# EasyEDA Pro project MSPM0G3507.eprj, schematic V1
Create Date: 2024-07-22; Page Name: P1; Project Name: MSPM0G3507; Schematic Name: V1; Update Date: 2024-07-22
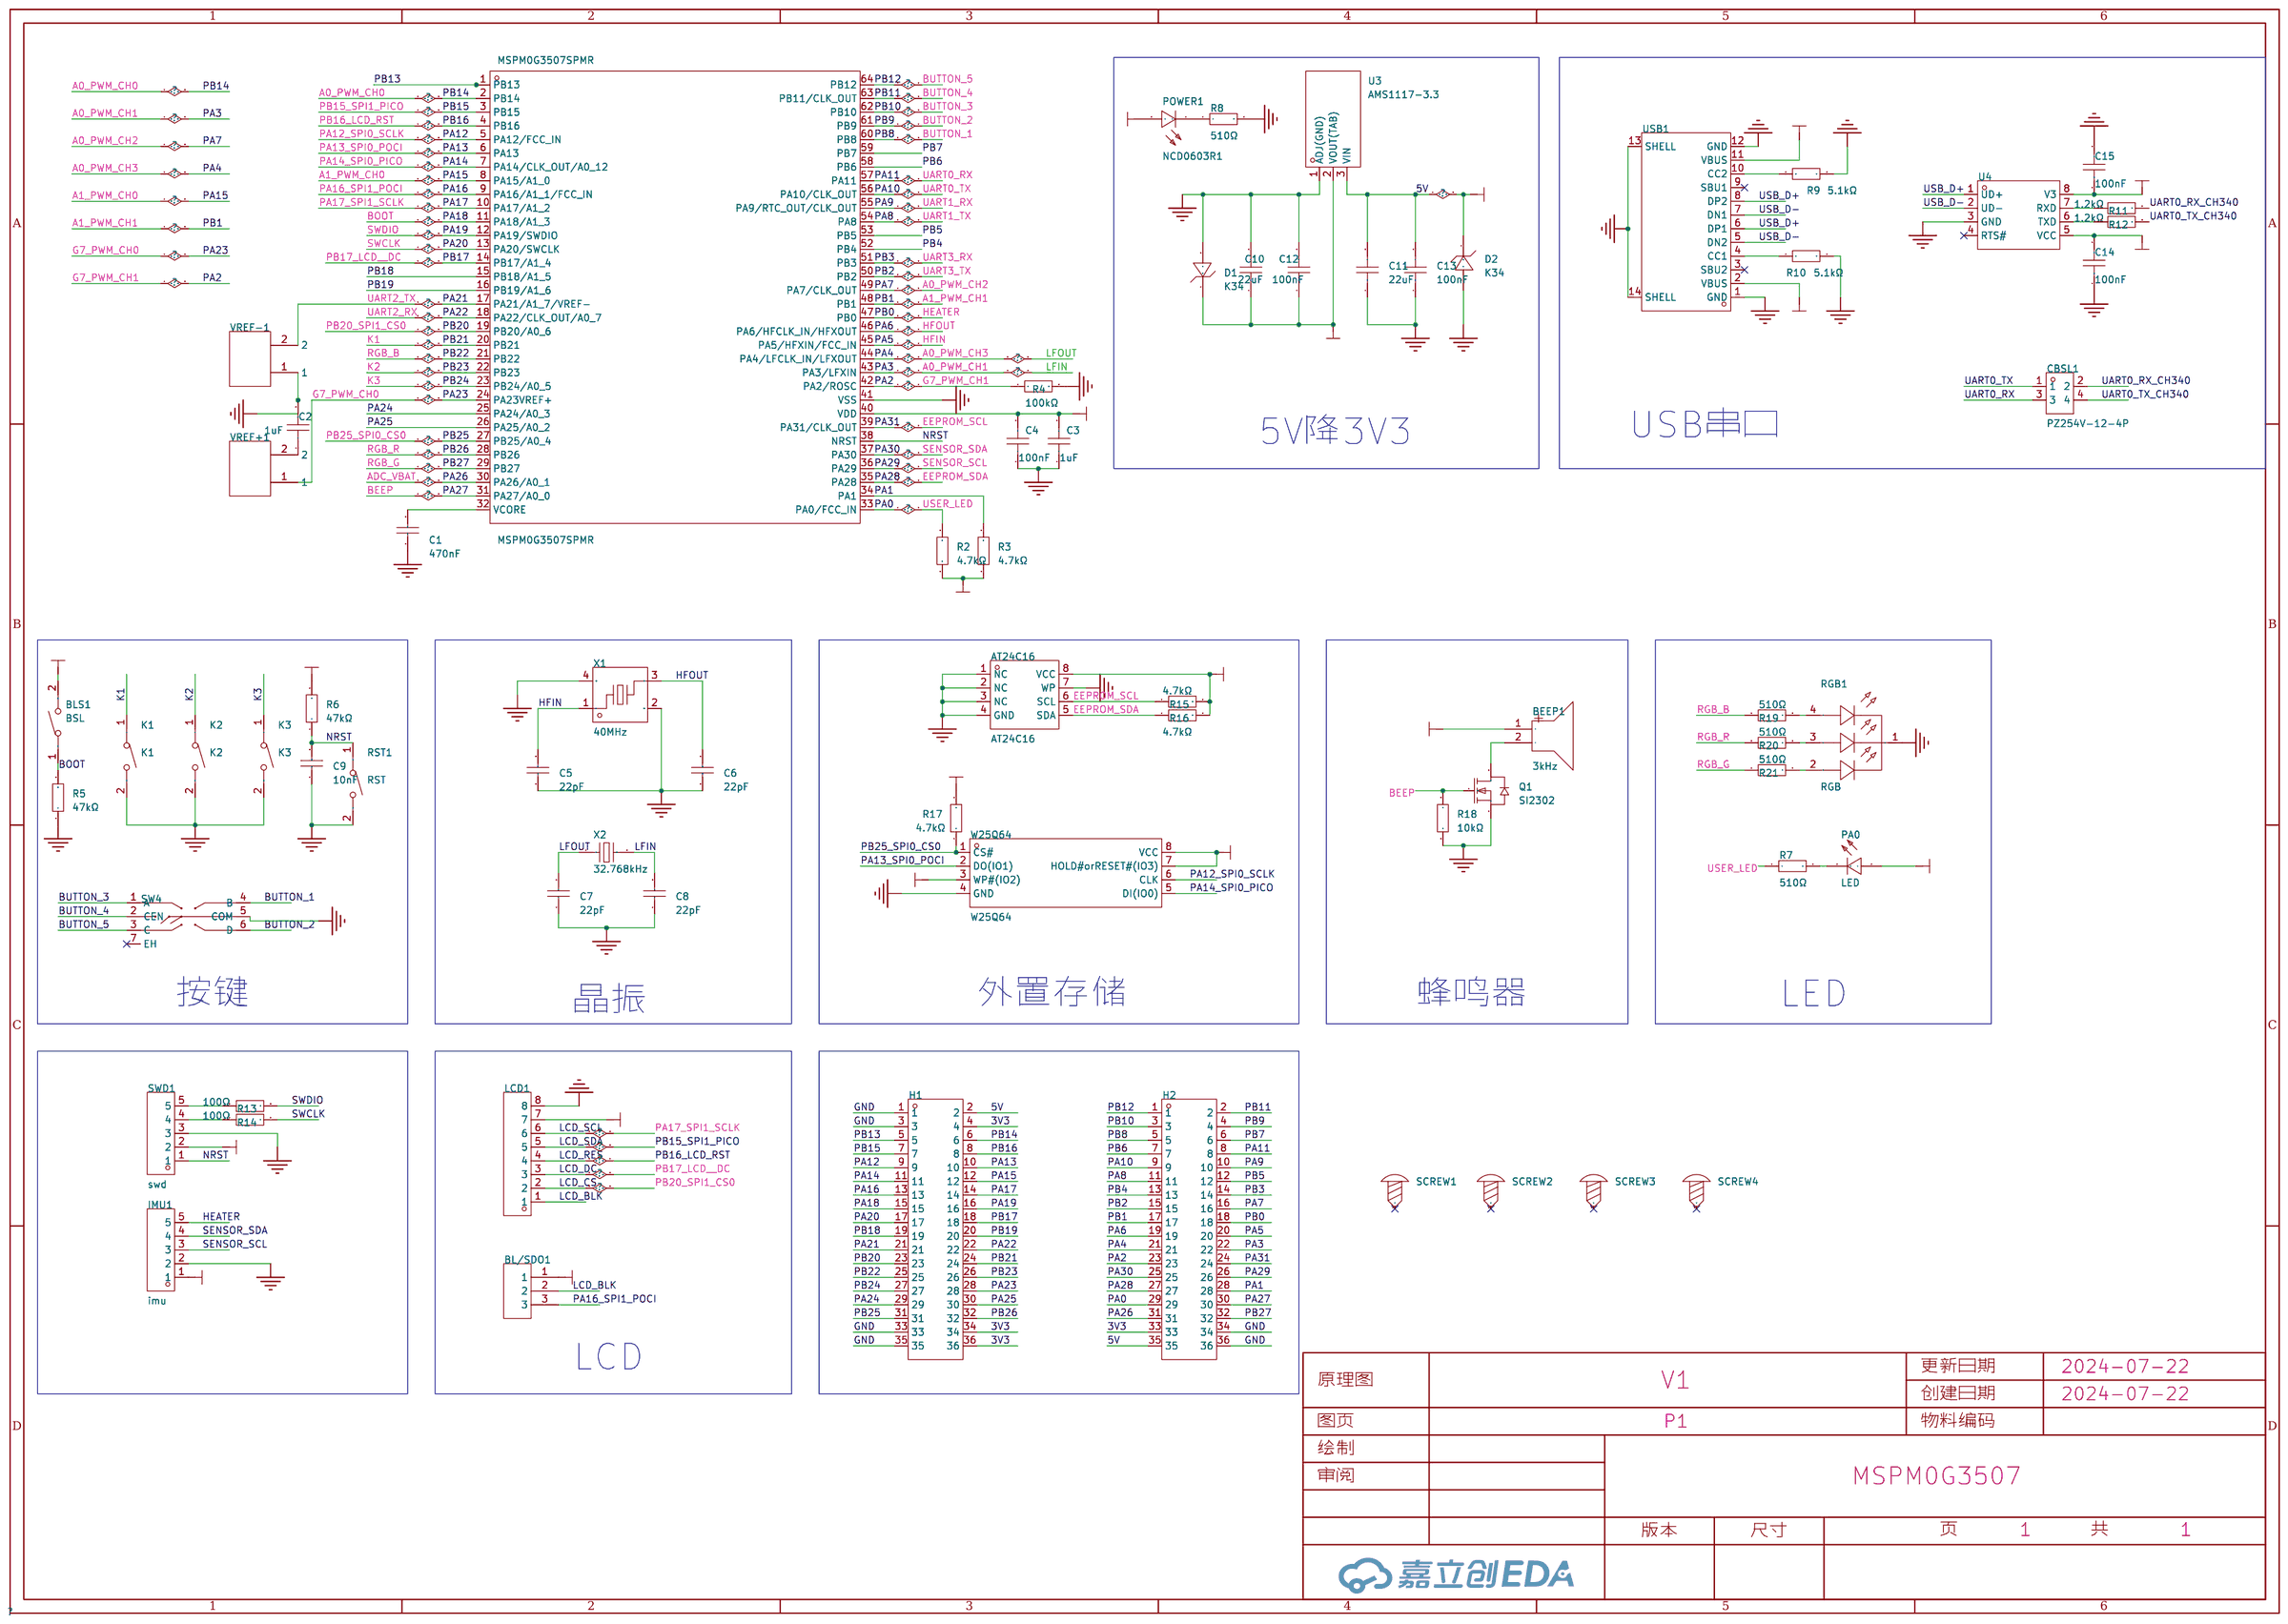
[diagram p0: schematic sheet]

## Parts
AT24C16  AT24C16  [SOP-8_L5.0-W4.0-P1.27-LS6.0-BL]
BEEP1  3kHz  [BUZ-TH_BD9.0-P5.00-D0.6-FD]
BL/SDO1  -  [3焊盘短接]
BLS1  BSL  [SW-SMD_L3.9-W3.0-P4.45]
C1  470nF  [C0603]
C2  1uF  [C0603]
C3  1uF  [C0603]
C4  100nF  [C0603]
C5  22pF  [C0603]
C6  22pF  [C0603]
C7  22pF  [C0603]
C8  22pF  [C0603]
C9  10nF  [C0603]
C10  22uF  [C0603]
C11  22uF  [C0603]
C12  100nF  [C0603]
C13  100nF  [C0603]
C14  100nF  [C0603]
C15  100nF  [C0603]
CBSL1  PZ254V-12-4P  [HDR-TH_4P-P2.54-V-M-R2-C2-S2.54]
D1  K34  [SOD-123FL_L2.8-W1.8-LS3.7-RD-1]
D2  K34  [SOD-123FL_L2.8-W1.8-LS3.7-RD-1]
H1  X6521WV-2x18H-C60D30  [HDR-TH_36P-2.54-V-M-R2-C18-S2.54]
H2  X6521WV-2x18H-C60D30  [HDR-TH_36P-2.54-V-M-R2-C18-S2.54]
IMU1  imu  [CONN-TH_5P-P2.50_ZX-XH2.54-5PZZ]
K1  K1  [SW-SMD_L3.9-W3.0-P4.45]
K2  K2  [SW-SMD_L3.9-W3.0-P4.45]
K3  K3  [SW-SMD_L3.9-W3.0-P4.45]
LCD1  PM254-1-08-Z-8.5  [HDR-TH_8P-P2.54-V-F]
MSPM0G3507SPMR  MSPM0G3507SPMR  [LQFP-64_L10.0-W10.0-P0.50-LS12.0-BL]
PA0  LED  [LED0603-RD_RED]
POWER1  NCD0603R1  [LED0603-RD_RED]
Q1  SI2302  [SOT-23-3_L2.9-W1.3-P1.90-LS2.4-BR]
R2  4.7kΩ  [R0603]
R3  4.7kΩ  [R0603]
R4  100kΩ  [R0603]
R5  47kΩ  [R0603]
R6  47kΩ  [R0603]
R7  510Ω  [R0603]
R8  510Ω  [R0603]
R9  5.1kΩ  [R0603]
R10  5.1kΩ  [R0603]
R11  1.2kΩ  [R0603]
R12  1.2kΩ  [R0603]
R13  100Ω  [R0603]
R14  100Ω  [R0603]
R15  4.7kΩ  [R0603]
R16  4.7kΩ  [R0603]
R17  4.7kΩ  [R0603]
R18  10kΩ  [R0603]
R19  510Ω  [R0603]
R20  510Ω  [R0603]
R21  510Ω  [R0603]
RGB1  RGB  [LED-ARRAY-SMD_4P-L3.2-W2.8-LS3.5-BL_XL-A3528RGBC-BM]
RST1  RST  [SW-SMD_L3.9-W3.0-P4.45]
SCREW1  -  [M3螺丝]
SCREW2  -  [M3螺丝]
SCREW3  -  [M3螺丝]
SCREW4  -  [M3螺丝]
SW4  TM-4175-B-A  [SW-SMD_TM-4175-B-X]
SWD1  swd  [CONN-TH_5P-P2.50_ZX-XH2.54-5PZZ]
U3  AMS1117-3.3  [SOT-89_L4.5-W2.5-P1.50-LS4.2-BR]
U4  CH340N  [SOP-8_L4.9-W3.9-P1.27-LS6.0-BL]
USB1  TYPE-C 16PIN 2MD(073)  [USB-C-SMD_TYPE-C-6PIN-2MD-073]
VREF+1  -  [VREF]
VREF-1  -  [VREF]
W25Q64  W25Q64  [SOIC-8_L5.3-W5.3-P1.27-LS8.0-BL]
X1  40MHz  [CRYSTAL-SMD_4P-L3.2-W2.5-BL]
X2  32.768kHz  [OSC-SMD_L3.2-W1.5]

## Library data of the parts
AT24C16 = AT24C16_C561263: 接口类型:I2C;存储容量:-;时钟频率(fc):400kHz~1MHz;工作电压:1.8V~5.5V;读-工作电流:400uA;写-工作电流:2mA;待机电流:1uA;写周期时间(Tw):5ms;数据保留 - TDR(年):100年;写周期寿命:1000000次;工作温度:-40℃~+85℃;; LCSC Part Name: I2C Twc=5ms; Supplier Part: C561263; Manufacturer: IDCHIP(英锐芯); Supplier Footprint: SOP-8; JLCPCB Part Class: 扩展库; Datasheet: https://atta.szlcsc.com/upload/public/pdf/source/20200527/C561263_AC234663A499CF0B5C3BE8C2059C2B18.pdf; Supplier: LCSC; Interface Type: I2C; Clock Frequency (fc): 400kHz~1MHz; Supply Voltage: 1.8V~5.5V; Supply Current (Read): 400uA; Supply Current (Write): 2mA; Standby supply current: 1uA; Write Cycle Time (Tw): 5ms; Data Retention - TDR (Year): 100年; Write Cycle Endurance: 1000000次; Operating Temperature: -40℃~+85℃
BEEP1 = HNB09A03: 驱动方式:有源(内含驱动线路);构造类型:电磁式;额定电压:3V;工作电压:1.5V~4.5V;消耗电流:30mA;频率:3kHz;声压(SPL):85dB@10cm;直径(φD):9mm;长度:-;宽度:-;高度:5.5mm;工作温度:-20℃~+70℃;; LCSC Part Name: 电磁式有源一体蜂鸣器HNB09A03; Supplier Part: C96102; Manufacturer: 华能; Supplier Footprint: 插件,D=9mm; JLCPCB Part Class: 扩展库; Datasheet: https://atta.szlcsc.com/upload/public/pdf/source/20170522/1495448326172.pdf; Supplier: LCSC; Oscillator Circuit: 有源(内含驱动线路); Technology Type: 电磁式; Rated Voltage: 3V; Operating Voltage: 1.5V~4.5V; Current Consumption: 30mA; Sound Pressure Level (SPL): 85dB@10cm; Diameter (φD): 9mm; Height: 5.5mm; Operating Temperature: -20℃~+70℃
BL/SDO1 = 3焊盘短接
BLS1 K1-K3 RST1 = TS-1088-AR02016: 电路结构:单刀单掷;按钮形状:圆形按钮;作用力:160gf;安装方式:立贴;开关长度:4mm;开关宽度:3mm;开关高度:2mm;带支架:不带;触点电流:50mA;额定电压(DC):12V;绝缘电阻:100MΩ;机械寿命:10万次;; LCSC Part Name: 4*3*2mm 立贴 轻触开关; Supplier Part: C720477; Manufacturer: XUNPU(讯普); Supplier Footprint: SMD; JLCPCB Part Class: Extended Part; Datasheet: https://atta.szlcsc.com/upload/public/pdf/source/20200810/C720475_60D09DD6C54279ADDB2DC25100F1CC11.pdf; Supplier: LCSC; Circuit: 单刀单掷; Actuator Style: 圆形按钮; Operating Force: 160gf; Mounting Style: 立贴; Switch Length: 4mm; Switch Width: 3mm; Switch Height: 2mm; Strike Gundam: 不带; Contact Current: 50mA; Voltage Rating (DC): 12V; Insulation Resistance: 100MΩ; Actuator/Cap Color: 黑色; Pin Style: SMD接片; Mechanical Life: 10万次; Operating Temperature: -30℃~+80℃
C1 = CL10B474KA8NNNC: 容值:470nF;精度:±10%;额定电压:25V;材质(温度系数):X7R;; LCSC Part Name: 470nF ±10% 25V; Supplier Part: C1623; Manufacturer: SAMSUNG(三星); Supplier Footprint: 0603; JLCPCB Part Class: Basic Part; Datasheet: https://atta.szlcsc.com/upload/public/pdf/source/20160218/1457707763339.pdf; Supplier: LCSC; Tolerance: ±10%; Voltage Rated: 25V; Temperature Coefficient: X7R
C2 C3 = CL10A105KB8NNNC: 容值:1uF;精度:±10%;额定电压:50V;材质(温度系数):X5R;; LCSC Part Name: 1uF ±10% 50V; Supplier Part: C15849; Manufacturer: SAMSUNG(三星); Supplier Footprint: 0603; JLCPCB Part Class: Basic Part; Datasheet: https://atta.szlcsc.com/upload/public/pdf/source/20160218/1457707763339.pdf; Supplier: LCSC; Tolerance: ±10%; Voltage Rated: 50V; Temperature Coefficient: X5R
C4 C12-C15 = CC0603KRX7R9BB104: 容值:100nF;精度:±10%;额定电压:50V;材质(温度系数):X7R;; LCSC Part Name: 100nF ±10% 50V; Supplier Part: C14663; Manufacturer: YAGEO(国巨); Supplier Footprint: 0603; JLCPCB Part Class: Basic Part; Datasheet: https://atta.szlcsc.com/upload/public/pdf/source/20180910/C282072_33301C7F631E79921B82A8DAC6BCC5B3.pdf; Supplier: LCSC; Tolerance: ±10%; Voltage Rated: 50V; Temperature Coefficient: X7R
C5-C8 = CC0603JRNPO9BN220: 容值:22pF;精度:±5%;额定电压:50V;材质(温度系数):NP0;; LCSC Part Name: 22pF ±5% 50V; Supplier Part: C105620; Manufacturer: YAGEO(国巨); Supplier Footprint: 0603; JLCPCB Part Class: Extended Part; Datasheet: https://atta.szlcsc.com/upload/public/pdf/source/20170505/1493957838062.pdf; Supplier: LCSC; Tolerance: ±5%; Voltage Rated: 50V; Temperature Coefficient: NP0
C9 = CC0603KRX7R9BB103: 容值:10nF;精度:±10%;额定电压:50V;材质(温度系数):X7R;; LCSC Part Name: 10nF ±10% 50V; Supplier Part: C100042; Manufacturer: YAGEO(国巨); Supplier Footprint: 0603; JLCPCB Part Class: Extended Part; Datasheet: https://atta.szlcsc.com/upload/public/pdf/source/20181008/C309510_22F155564471FAF6A489F7D68F34234E.pdf; Supplier: LCSC; Tolerance: ±10%; Voltage Rated: 50V; Temperature Coefficient: X7R
C10 C11 = CL10A226MQ8NRNC: 容值:22uF;精度:±20%;额定电压:6.3V;材质(温度系数):X5R;; LCSC Part Name: 22uF ±20% 6.3V; Supplier Part: C59461; Manufacturer: SAMSUNG(三星); Supplier Footprint: 0603; JLCPCB Part Class: Basic Part; Datasheet: https://atta.szlcsc.com/upload/public/pdf/source/20160218/1457707763339.pdf; Supplier: LCSC; Tolerance: ±20%; Voltage Rated: 6.3V; Temperature Coefficient: X5R
CBSL1 = PZ254V-12-4P: 插针结构:2x2P;间距:2.54mm;行距:2.54mm;圆针/方针:方针;安装类型:直插;排数:双排;总PIN位数:4P;额定电流:-;额定电压:-;配合针长度:6mm;塑高:2.5mm;端接针长度:3mm;触头材质:黄铜;触头镀层:-;工作温度范围:-40℃~+105℃;颜色:黑色;; LCSC Part Name: 间距:2.54mm 2x2P 直插 方针; Supplier Part: C492419; Manufacturer: XFCN(兴飞); Supplier Footprint: 插件,P=2.54mm; JLCPCB Part Class: Extended Part; Datasheet: https://atta.szlcsc.com/upload/public/pdf/source/20200309/C492419_0001C06E73AFF21BD0ED3D7CEEF46D29.pdf; Supplier: LCSC; Pin Structure: 2x2P; Pitch: 2.54mm; Row Spacing: 2.54mm; Circluar Pins/Square Pins: 方针; Mounting Type: 直插; Number of Rows: 双排; Number of Pins: 4P; Length of Mating Pin: 6mm; Insulation Height: 2.5mm; Length of End Connection Pin: 3mm; Contact Material: 黄铜; Operating Temperature Range: -40℃~+105℃; Color: 黑色
D1 D2 = K34: 二极管配置:独立式;正向压降(Vf):850mV@3A;直流反向耐压(Vr):40V;平均整流电流(Io):3A;; LCSC Part Name: 电压:40V 电流:3A; Supplier Part: C908665; Manufacturer: GOODWORK(固得沃克); Supplier Footprint: SOD-123FL; JLCPCB Part Class: Extended Part; Datasheet: https://atta.szlcsc.com/upload/public/pdf/source/20201231/C908665_476F43B470A86367292480C41C9181B5.pdf; Supplier: LCSC; Diode Configuration: 独立式; Forward Voltage (Vf@If): 850mV@3A; Reverse Voltage (Vr): 40V; Average Rectified Current (Io): 3A; Reverse Leakage Current (Ir): 20uA@100V
H1 H2 = X6521WV-2x18H-C60D30: 插针结构:2x18P;间距:2.54mm;行距:2.54mm;圆针/方针:方针;安装类型:-;排数:双排;总PIN位数:36P;额定电流:3A;额定电压:250V;配合针长度:6mm;塑高:2.5mm;端接针长度:3mm;触头材质:黄铜;触头镀层:金;工作温度范围:-40℃~+105℃;焊接温度(最大值):260℃;颜色:黑色;; LCSC Part Name: 2x18P 间距:2.54mm 方针; Supplier Part: C725890; Manufacturer: XKB Connection(中国星坤); Supplier Footprint: 插件,P=2.54mm; JLCPCB Part Class: Extended Part; Datasheet: https://atta.szlcsc.com/upload/public/pdf/source/20211009/DE33EBA4104B5B447A7BD8383FBBA145.pdf; Supplier: LCSC; Pin Structure: 2x18P; Pitch: 2.54mm; Row Spacing: 2.54mm; Circluar Pins/Square Pins: 方针; Number of Rows: 双排; Number of Pins: 36P; Current Rating (Max): 3A; Voltage Rating (Max): 250V; Length of Mating Pin: 6mm; Insulation Height: 2.5mm; Length of End Connection Pin: 3mm; Contact Material: 黄铜; Contact Plating: 金; Operating Temperature Range: -40℃~+105℃; Soldering Temperature(Max): 260℃; Color: 黑色
IMU1 SWD1 = ZX-XH2.54-5PZZ: 插针结构:1x5P;间距:2.54mm;安装方式:直插;参考系列:XH;总PIN数:5P;排数:1;每排PIN数:5;行距:-;额定电流:3A;触头材质:黄铜;触头镀层:锡;工作温度范围:-25℃~+85℃;; Supplier Part: C7429635; Manufacturer: Megastar(兆星); Supplier Footprint: 插件,P=2.54mm; JLCPCB Part Class: Extended Part; Datasheet: https://atta.szlcsc.com/upload/public/pdf/source/20230619/60EEF4ADD558E90BFFACF5D939816781.pdf; Supplier: LCSC; Pins Structure: 1x5P; Pitch: 2.54mm; Mounting Style: 直插; Reference Series: XH; Number of Pins: 5P; Number of Rows: 1; Number of PINs Per Row: 5; Current Rating (Max): 3A; Contact Material: 黄铜; Contact Plating: 锡; Operating Temperature Range: -25℃~+85℃
LCD1 = PM254-1-08-Z-8.5: 插孔结构:1x8P;间距:2.54mm;行距:-;圆孔/方孔:方孔;安装类型:直插;排数:单排;总孔位数:8P;额定电流:3A;额定电压:-;插孔方向:顶部;塑高:8.5mm;触头材质:铜合金;工作温度范围:-40℃~+105℃;焊接温度(最大值):260℃@5S;; LCSC Part Name: 1x8P 间距:2.54mm 直插; Supplier Part: C2897371; Manufacturer: HCTL(华灿天禄); Supplier Footprint: 插件,P=2.54mm; JLCPCB Part Class: Extended Part; Datasheet: https://atta.szlcsc.com/upload/public/pdf/source/20230609/534BE42964C679BDE98E061007C4ABD6.pdf; Supplier: LCSC; Holes Structure: 1x8P; Pitch: 2.54mm; Circular Hole / Square Hole: 方孔; Mounting Type: 直插; Number of Rows: 单排; Number of Holes: 8P; Current Rating (Max): 3A; Holes Direction: 顶部; Insulation Height: 8.5mm; Contact Material: 铜合金; Operating Temperature Range: -40℃~+105℃; Soldering Temperature(Max): 260℃@5S
MSPM0G3507SPMR = MSPM0G3507SPMR_C22389960: Supplier Part: C22389960; Manufacturer: TI(德州仪器); Supplier Footprint: LQFP-64(10x10); JLCPCB Part Class: Extended Part; Datasheet: https://atta.szlcsc.com/upload/public/pdf/source/20240621/D7254EAE03B6DB9B67DC0EA221DC405D.pdf; Supplier: LCSC
PA0 = NCD0603R1_C84263: 灯头类型:-;发光颜色:红色;正向电压(VF):1.6V~2.6V;功率:65mW;正向电流:20mA;主波长:615nm~630nm;二极管配置:独立二极管;透镜颜色:无色透明透镜;色温:-;发光强度:80mcd~220mcd;发光角度:130°;载带方式:-;工作温度:-30℃~+85℃;; LCSC Part Name: NCD0603R1; Supplier Part: C84263; Manufacturer: 国星光电; Supplier Footprint: 0603; JLCPCB Part Class: Extended Part; Datasheet: https://atta.szlcsc.com/upload/public/pdf/source/20200820/C84263_DABC6A75E58F576973B407FDBA283D60.pdf; Supplier: LCSC; Emitted Color: 红色; Forward Voltage (VF): 1.6V~2.6V; Power Dissipation: 65mW; Forward Current: 20mA; Dominant Wavelength: 615nm~630nm; Diode Configuration: 独立二极管; Lens Color: 无色透明透镜; Luminous Intensity: 80mcd~220mcd; Viewing Angle: 130°; Operating Temperature: -30℃~+85℃
POWER1 = NCD0603R1_C84263: 灯头类型:-;发光颜色:红色;正向电压(VF):1.6V~2.6V;功率:65mW;正向电流:20mA;主波长:615nm~630nm;二极管配置:独立二极管;透镜颜色:无色透明透镜;色温:-;发光强度:80mcd~220mcd;发光角度:130°;载带方式:-;工作温度:-30℃~+85℃;; Supplier Part: C84263; Manufacturer: 国星光电; Supplier Footprint: 0603; JLCPCB Part Class: Extended Part; Datasheet: https://atta.szlcsc.com/upload/public/pdf/source/20200820/C84263_DABC6A75E58F576973B407FDBA283D60.pdf; Supplier: LCSC; Emitted Color: 红色; Forward Voltage (VF): 1.6V~2.6V; Power Dissipation: 65mW; Forward Current: 20mA; Dominant Wavelength: 615nm~630nm; Diode Configuration: 独立二极管; Lens Color: 无色透明透镜; Luminous Intensity: 80mcd~220mcd; Viewing Angle: 130°; Operating Temperature: -30℃~+85℃
Q1 = SI2302-HXY: 类型:1个N沟道;漏源电压(Vdss):20V;连续漏极电流(Id):2.8A;功率(Pd):900mW;导通电阻(RDS(on)@Vgs,Id):55mΩ@4.5V,2.8A;阈值电压(Vgs(th)@Id):1.2V@250uA;; LCSC Part Name: 1个N沟道 耐压:20V 电流:2.8A; Supplier Part: C4748714; Manufacturer: HXY MOSFET(华轩阳电子); Supplier Footprint: SOT-23; JLCPCB Part Class: Extended Part; Datasheet: https://atta.szlcsc.com/upload/public/pdf/source/20220720/B2EC63D46AD65363D9D3692163B46869.pdf; Supplier: LCSC; Type: 1个N沟道; Drain Source Voltage (Vdss): 20V; Continuous Drain Current (Id): 2.8A; Power Dissipation (Pd): 900mW; Drain Source On Resistance (RDS(on)@Vgs,Id): 55mΩ@4.5V,2.8A; Gate Threshold Voltage (Vgs(th)@Id): 1.2V@250uA; Input Capacitance (Ciss@Vds): 260pF@10V
R2 R3 R15-R17 = 0603WAF4701T5E: 电阻类型:厚膜电阻;阻值:4.7kΩ;精度:±1%;功率:100mW;最大工作电压:75V;温度系数:±100ppm/℃;; LCSC Part Name: 4.7kΩ ±1% 100mW 厚膜电阻; Supplier Part: C23162; Manufacturer: UNI-ROYAL(厚声); Supplier Footprint: 0603; JLCPCB Part Class: Basic Part; Datasheet: https://atta.szlcsc.com/upload/public/pdf/source/20200306/C422600_1E6D84923E4A46A82E41ADD87F860B5C.pdf; Supplier: LCSC; Type: 厚膜电阻; Tolerance: ±1%; Power(Watts): 100mW; Overload Voltage (Max): 75V; Temperature Coefficient: ±100ppm/℃; Operating Temperature Range: -55℃~+155℃
R4 = RC0603FR-07100KL: 电阻类型:厚膜电阻;阻值:100kΩ;精度:±1%;功率:100mW;最大工作电压:75V;温度系数:±100ppm/℃;; LCSC Part Name: 厚膜电阻 100kΩ ±1% 100mW; Supplier Part: C14675; Manufacturer: YAGEO(国巨); Supplier Footprint: 0603; JLCPCB Part Class: Extended Part; Datasheet: https://atta.szlcsc.com/upload/public/pdf/source/20140324/1457707028752.pdf; Supplier: LCSC; Type: 厚膜电阻; Tolerance: ±1%; Power(Watts): 100mW; Overload Voltage (Max): 75V; Temperature Coefficient: ±100ppm/℃; Operating Temperature Range: -55℃~+155℃
R5 R6 = 0603WAF4702T5E: 电阻类型:厚膜电阻;阻值:47kΩ;精度:±1%;功率:100mW;最大工作电压:75V;温度系数:±100ppm/℃;; LCSC Part Name: 47kΩ ±1% 100mW 厚膜电阻; Supplier Part: C25819; Manufacturer: UNI-ROYAL(厚声); Supplier Footprint: 0603; JLCPCB Part Class: Basic Part; Datasheet: https://atta.szlcsc.com/upload/public/pdf/source/20200306/C422600_1E6D84923E4A46A82E41ADD87F860B5C.pdf; Supplier: LCSC; Type: 厚膜电阻; Tolerance: ±1%; Power(Watts): 100mW; Overload Voltage (Max): 75V; Temperature Coefficient: ±100ppm/℃; Operating Temperature Range: -55℃~+155℃
R7 R8 R19-R21 = 0603WAF5100T5E: 电阻类型:厚膜电阻;阻值:510Ω;精度:±1%;功率:100mW;最大工作电压:75V;温度系数:±100ppm/℃;; LCSC Part Name: 510Ω ±1% 100mW 厚膜电阻; Supplier Part: C23193; Manufacturer: UNI-ROYAL(厚声); Supplier Footprint: 0603; JLCPCB Part Class: Basic Part; Datasheet: https://atta.szlcsc.com/upload/public/pdf/source/20200306/C422600_1E6D84923E4A46A82E41ADD87F860B5C.pdf; Supplier: LCSC; Type: 厚膜电阻; Tolerance: ±1%; Power(Watts): 100mW; Overload Voltage (Max): 75V; Temperature Coefficient: ±100ppm/℃; Operating Temperature Range: -55℃~+155℃
R9 R10 = 0603WAF5101T5E: 电阻类型:厚膜电阻;阻值:5.1kΩ;精度:±1%;功率:100mW;最大工作电压:75V;温度系数:±100ppm/℃;; LCSC Part Name: 5.1kΩ ±1% 100mW 厚膜电阻; Supplier Part: C23186; Manufacturer: UNI-ROYAL(厚声); Supplier Footprint: 0603; JLCPCB Part Class: 基础库; Datasheet: https://atta.szlcsc.com/upload/public/pdf/source/20200306/C422600_1E6D84923E4A46A82E41ADD87F860B5C.pdf; Supplier: LCSC; Type: 厚膜电阻; Tolerance: ±1%; Power(Watts): 100mW; Overload Voltage (Max): 75V; Temperature Coefficient: ±100ppm/℃; Operating Temperature Range: -55℃~+155℃
R11 R12 = 0603WAF1201T5E: 电阻类型:厚膜电阻;阻值:1.2kΩ;精度:±1%;功率:100mW;最大工作电压:75V;温度系数:±100ppm/℃;; LCSC Part Name: 1.2kΩ ±1% 100mW 厚膜电阻; Supplier Part: C22765; Manufacturer: UNI-ROYAL(厚声); Supplier Footprint: 0603; JLCPCB Part Class: Basic Part; Datasheet: https://atta.szlcsc.com/upload/public/pdf/source/20200306/C422600_1E6D84923E4A46A82E41ADD87F860B5C.pdf; Supplier: LCSC; Type: 厚膜电阻; Tolerance: ±1%; Power(Watts): 100mW; Overload Voltage (Max): 75V; Temperature Coefficient: ±100ppm/℃; Operating Temperature Range: -55℃~+155℃
R13 R14 = RC0603FR-07100RL: 电阻类型:厚膜电阻;阻值:100Ω;精度:±1%;功率:100mW;最大工作电压:75V;温度系数:±100ppm/℃;; LCSC Part Name: 厚膜电阻 100Ω ±1% 100mW; Supplier Part: C105588; Manufacturer: YAGEO(国巨); Supplier Footprint: 0603; JLCPCB Part Class: Extended Part; Datasheet: https://atta.szlcsc.com/upload/public/pdf/source/20180316/70C0E2BDAE7FCC62C531A5A58D202EE1.pdf; Supplier: LCSC; Type: 厚膜电阻; Tolerance: ±1%; Power(Watts): 100mW; Overload Voltage (Max): 75V; Temperature Coefficient: ±100ppm/℃; Operating Temperature Range: -55℃~+155℃
R18 = 0603WAF1002T5E: 电阻类型:厚膜电阻;阻值:10kΩ;精度:±1%;功率:100mW;最大工作电压:75V;温度系数:±100ppm/℃;; LCSC Part Name: 厚膜电阻 10kΩ ±1% 100mW; Supplier Part: C25804; Manufacturer: UNI-ROYAL(厚声); Supplier Footprint: 0603; JLCPCB Part Class: Basic Part; Datasheet: https://atta.szlcsc.com/upload/public/pdf/source/20200306/C422600_1E6D84923E4A46A82E41ADD87F860B5C.pdf; Supplier: LCSC; Type: 厚膜电阻; Tolerance: ±1%; Power(Watts): 100mW; Overload Voltage (Max): 75V; Temperature Coefficient: ±100ppm/℃; Operating Temperature Range: -55℃~+155℃
RGB1 = XL-A3528RGBC-BM: 3528七彩白面共阴; Supplier Part: C3647023; Manufacturer: XINGLIGHT(成兴光); Supplier Footprint: SMD3528; JLCPCB Part Class: Extended Part; Datasheet: https://atta.szlcsc.com/upload/public/pdf/source/20220704/E3364CF2D36F9369DBF893AA78774C14.pdf; Supplier: LCSC
SCREW1-SCREW4 = M3螺丝: Supplier Footprint: 插件
SW4 = TM-4175-B-A: 多功能开关 7.5*7.5*5 五向开关 H5; LCSC Part Name: 多功能开关 7.5*7.5*5 五向开关 H5; Supplier Part: C465995; Manufacturer: XKB Connectivity(中国星坤); Supplier Footprint: SMD-8P,7.5x7.5mm; JLCPCB Part Class: Extended Part; Datasheet: https://atta.szlcsc.com/upload/public/pdf/source/20211011/A0F6117F2AB0E02F6CF3847B7456F266.pdf; Supplier: LCSC
U3 = AMS1117-3.3_C347256: 输出类型:固定;最大输入电压:12V;输出电压:3.3V;最大输出电流:1A;电源纹波抑制比(PSRR):60dB@(120Hz);输出极性:正极;; LCSC Part Name: 输出:3.3V 电流:1A 耐压:12V; Supplier Part: C347256; Manufacturer: UMW(友台半导体); Supplier Footprint: SOT-89; JLCPCB Part Class: Extended Part; Datasheet: https://atta.szlcsc.com/upload/public/pdf/source/20231109/155D79A26D9DB04352555A58D5969DC8.pdf; Supplier: LCSC; Output Type: 固定; Maximum Input Voltage: 12V; Output Voltage: 3.3V; MAX Output Current: 1A; Power Supply Rejection Ratio (PSRR): 60dB@(120Hz); Dropout Voltage: 1.3V@(1A); Output Polarity: 正极; Number of Outputs: 1
U4 = CH340N: LCSC Part Name: USB转串口芯片 CH340; Supplier Part: C2977777; Manufacturer: WCH(南京沁恒); Supplier Footprint: SOP-8; JLCPCB Part Class: 扩展库; Datasheet: https://atta.szlcsc.com/upload/public/pdf/source/20230530/6E401E9554E9F5311886CC8B3F89B62E.pdf; Supplier: LCSC
USB1 = TYPE-C 16PIN 2MD(073): 连接器类型:Type-C;标准:-;公母:母;端口数量:1;触点数量:16P;安装方式:卧贴;额定电流 - 电源:5A;工作温度范围:-25℃~+85℃;; LCSC Part Name: Type-C 母 卧贴; Supplier Part: C2765186; Manufacturer: SHOU HAN(首韩); Supplier Footprint: SMD; JLCPCB Part Class: 扩展库; Datasheet: https://atta.szlcsc.com/upload/public/pdf/source/20211123/39B17C16241EAC15C5E277BDA434118E.pdf; Supplier: LCSC; Connector Type: Type-C; Gender: 母; Number of Ports: 1; Number of Contacts: 16P; Mounting Style: 卧贴; Current Rating - Power (Max): 5A; Operating Temperature Range: -25℃~+85℃
VREF+1 VREF-1 = VREF
W25Q64 = W25Q64JVSSIQ: Supplier Part: C179171; Manufacturer: WINBOND(华邦); Supplier Footprint: SOIC-8-208mil; JLCPCB Part Class: Extended Part; Datasheet: https://atta.szlcsc.com/upload/public/pdf/source/20191218/C179171_92C5C91D0324539EDD8F1160D2E79C0F.pdf; Supplier: LCSC
X1 = XC322540MOB4SA-18: 晶振类型:贴片晶振;频率:40MHz;常温频差:±10ppm;外接负载电容:12pF;频率稳定度(全温):±80ppm;; LCSC Part Name: 40MHz ±10ppm 12pF YSX321SC YSX321SC; Supplier Part: C3294354; Manufacturer: YXC(扬兴晶振); Supplier Footprint: SMD3225-4P; JLCPCB Part Class: Extended Part; Datasheet: https://atta.szlcsc.com/upload/public/pdf/source/20240329/6AE8ACEB6AA3FDB5620339473EACF689.pdf; Supplier: LCSC; Crystal Type: 贴片晶振; Normal temperature Frequency Tolerance: ±10ppm; External load capacitor: 12pF; Frequency Stability(Full temperature range): ±80ppm; Operating Temperature: -40℃~+125℃
X2 = X321532768KGD2SI: 晶振类型:贴片晶振;频率:32.768kHz;常温频差:±20ppm;外接负载电容:12.5pF;频率稳定度(全温):-;; LCSC Part Name: 32.768kHz ±20ppm 12.5pF; Supplier Part: C620155; Manufacturer: YXC(扬兴晶振); Supplier Footprint: SMD3215-2P; JLCPCB Part Class: Extended Part; Datasheet: https://atta.szlcsc.com/upload/public/pdf/source/20240329/3A7650FD985DD0DE85694D3785AB4916.pdf; Supplier: LCSC; Crystal Type: 贴片晶振; Normal temperature Frequency Tolerance: ±20ppm; External load capacitor: 12.5pF; Operating Temperature: -40℃~+85℃

## Nets
3V3: AT24C16.8(VCC) BL/SDO1.1 BLS1.2 C3.2 C4.2 C10.1 C12.1 C14.2 C15.1 D1.1(C) H1.4 H1.34 H1.36 H2.33 LCD1.7 MSPM0G3507SPMR.40(VDD) PA0.2(A) POWER1.2(A) R2.1 R3.1 R6.2 R15.2 R16.2 R17.2 SWD1.2 U3.2(VOUT(TAB)) U4.5(VCC) U4.8(V3) W25Q64.3(WP#(IO2)) W25Q64.7(HOLD#orRESET#(IO3)) W25Q64.8(VCC)
GND: AT24C16.1(NC) AT24C16.2(NC) AT24C16.3(NC) AT24C16.4(GND) AT24C16.7(WP) C1.1 C2.2 C3.1 C4.1 C5.1 C6.1 C7.1 C8.1 C9.1 C10.2 C11.1 C12.2 C13.1 C14.1 C15.2 D1.2(A) D2.2(A) H1.1 H1.3 H1.33 H1.35 H2.34 H2.36 IMU1.2 K1.2 K2.2 K3.2 LCD1.8 MSPM0G3507SPMR.41(VSS) Q1.2(S) R4.2 R5.1 R8.2 R9.2 R10.2 R18.1 RGB1.1 RST1.2 SW4.5(COM) SWD1.3 U3.1(ADJ(GND)) U4.3(GND) USB1.1(GND) USB1.12(GND) USB1.13(SHELL) USB1.14(SHELL) VREF-1.1 W25Q64.4(GND) X1.2(GND) X1.4(GND)
VCC_5V: BEEP1.1(+) C11.2 C13.2 D2.1(C) H1.2 H2.35 IMU1.1 U3.3(VIN) USB1.2(VBUS) USB1.11(VBUS)
A0_PWM_CH0: H1.6 MSPM0G3507SPMR.2(PB14)
A0_PWM_CH1: C8.2 H2.22 MSPM0G3507SPMR.43(PA3/LFXIN) X2.2
A0_PWM_CH2: H2.16 MSPM0G3507SPMR.49(PA7/CLK_OUT)
A0_PWM_CH3: C7.2 H2.21 MSPM0G3507SPMR.44(PA4/LFCLK_IN/LFXOUT) X2.1
A1_PWM_CH0: H1.12 MSPM0G3507SPMR.8(PA15/A1_0)
A1_PWM_CH1: H2.17 MSPM0G3507SPMR.48(PB1)
ADC_VBAT: H2.31 MSPM0G3507SPMR.30(PA26/A0_1)
BEEP: H2.30 MSPM0G3507SPMR.31(PA27/A0_0) Q1.1(G) R18.2
BOOT: BLS1.1 H1.15 MSPM0G3507SPMR.11(PA18/A1_3) R5.2
BUTTON_1: H2.5 MSPM0G3507SPMR.60(PB8) SW4.4(B)
BUTTON_2: H2.4 MSPM0G3507SPMR.61(PB9) SW4.6(D)
BUTTON_3: H2.3 MSPM0G3507SPMR.62(PB10) SW4.1(A)
BUTTON_4: H2.2 MSPM0G3507SPMR.63(PB11/CLK_OUT) SW4.2(CEN)
BUTTON_5: H2.1 MSPM0G3507SPMR.64(PB12) SW4.3(C)
EEPROM_SCL: AT24C16.6(SCL) H2.24 MSPM0G3507SPMR.39(PA31/CLK_OUT) R15.1
EEPROM_SDA: AT24C16.5(SDA) H2.27 MSPM0G3507SPMR.35(PA28) R16.1
G7_PWM_CH0: H1.28 MSPM0G3507SPMR.24(PA23VREF+) VREF+1.1
G7_PWM_CH1: H2.23 MSPM0G3507SPMR.42(PA2/ROSC) R4.1
HEATER: H2.18 IMU1.5 MSPM0G3507SPMR.47(PB0)
HFIN: C5.2 H2.20 MSPM0G3507SPMR.45(PA5/HFXIN/FCC_IN) X1.1
HFOUT: C6.2 H2.19 MSPM0G3507SPMR.46(PA6/HFCLK_IN/HFXOUT) X1.3
K1: H1.24 K1.1 MSPM0G3507SPMR.20(PB21)
K2: H1.26 K2.1 MSPM0G3507SPMR.22(PB23)
K3: H1.27 K3.1 MSPM0G3507SPMR.23(PB24/A0_5)
LCD_BLK: BL/SDO1.2 LCD1.1
LCD_CS: H1.23 LCD1.2 MSPM0G3507SPMR.19(PB20/A0_6)
LCD_DC: H1.18 LCD1.3 MSPM0G3507SPMR.14(PB17/A1_4)
LCD_RES: H1.8 LCD1.4 MSPM0G3507SPMR.4(PB16)
LCD_SCL: H1.14 LCD1.6 MSPM0G3507SPMR.10(PA17/A1_2)
LCD_SDA: H1.7 LCD1.5 MSPM0G3507SPMR.3(PB15)
NRST: C9.2 MSPM0G3507SPMR.38(NRST) R6.1 RST1.1 SWD1.1
PA0: H2.29 MSPM0G3507SPMR.33(PA0/FCC_IN) R2.2 R7.1
PA1: H2.28 MSPM0G3507SPMR.34(PA1) R3.2
PA8: H2.11 MSPM0G3507SPMR.54(PA8)
PA9: H2.10 MSPM0G3507SPMR.55(PA9/RTC_OUT/CLK_OUT)
PA10: CBSL1.1 H2.9 MSPM0G3507SPMR.56(PA10/CLK_OUT)
PA11: CBSL1.3 H2.8 MSPM0G3507SPMR.57(PA11)
PA12: H1.9 MSPM0G3507SPMR.5(PA12/FCC_IN) W25Q64.6(CLK)
PA13: H1.10 MSPM0G3507SPMR.6(PA13) W25Q64.2(DO(IO1))
PA14: H1.11 MSPM0G3507SPMR.7(PA14/CLK_OUT/A0_12) W25Q64.5(DI(IO0))
PA16: BL/SDO1.3 H1.13 MSPM0G3507SPMR.9(PA16/A1_1/FCC_IN)
PA19: H1.16 MSPM0G3507SPMR.12(PA19/SWDIO) R13.2
PA20: H1.17 MSPM0G3507SPMR.13(PA20/SWCLK) R14.2
PA21: H1.21 MSPM0G3507SPMR.17(PA21/A1_7/VREF-) VREF-1.2
PA22: H1.22 MSPM0G3507SPMR.18(PA22/CLK_OUT/A0_7)
PA24: H1.29 MSPM0G3507SPMR.25(PA24/A0_3)
PA25: H1.30 MSPM0G3507SPMR.26(PA25/A0_2)
PA29: H2.26 IMU1.3 MSPM0G3507SPMR.36(PA29)
PA30: H2.25 IMU1.4 MSPM0G3507SPMR.37(PA30)
PB2: H2.15 MSPM0G3507SPMR.50(PB2)
PB3: H2.14 MSPM0G3507SPMR.51(PB3)
PB4: H2.13 MSPM0G3507SPMR.52(PB4)
PB5: H2.12 MSPM0G3507SPMR.53(PB5)
PB6: H2.7 MSPM0G3507SPMR.58(PB6)
PB7: H2.6 MSPM0G3507SPMR.59(PB7)
PB13: H1.5 MSPM0G3507SPMR.1(PB13)
PB18: H1.19 MSPM0G3507SPMR.15(PB18/A1_5)
PB19: H1.20 MSPM0G3507SPMR.16(PB19/A1_6)
PB22: H1.25 MSPM0G3507SPMR.21(PB22) R19.1
PB25: H1.31 MSPM0G3507SPMR.27(PB25/A0_4) R17.1 W25Q64.1(CS#)
PB26: H1.32 MSPM0G3507SPMR.28(PB26) R20.1
PB27: H2.32 MSPM0G3507SPMR.29(PB27) R21.1
UART0_RX_CH340: CBSL1.2 R11.2
UART0_TX_CH340: CBSL1.4 R12.2
USB_D+: U4.1(UD+) USB1.6(DP1) USB1.8(DP2)
USB_D-: U4.2(UD-) USB1.5(DN2) USB1.7(DN1)
$1N1665: C1.2 MSPM0G3507SPMR.32(VCORE)
$1N6377: PA0.1(K) R7.2
$1N7809: R9.1 USB1.10(CC2)
$1N7811: R10.1 USB1.4(CC1)
$1N8223: R11.1 U4.7(RXD)
$1N8226: R12.1 U4.6(TXD)
$1N10173: BEEP1.2(-) Q1.3(D)
Net-(C2-1): C2.1 VREF+1.2
Net-(POWER1-1): POWER1.1(K) R8.1
Net-(R13-1): R13.1 SWD1.5
Net-(R14-1): R14.1 SWD1.4
Net-(R19-2): R19.2 RGB1.4
Net-(R20-2): R20.2 RGB1.3
Net-(R21-2): R21.2 RGB1.2

Not connected (* = marked no-connect by the designer): SCREW1 1*; SCREW2 1*; SCREW3 1*; SCREW4 1*; SW4 7(EH)*; U4 4(RTS#)*; USB1 3(SBU2)* 9(SBU1)*

## Notes on the sheet
- 5V降3V3
- USB串口
- 按键
- 晶振
- 外置存储
- 蜂鸣器
- LED
- LCD
